# Altium schematic sheet RcMPPT-BMS-Interface.SchDoc: RcMPPT-BMS-Interface
size A4; Author: Thomas Hofmann; CompanyName: HTL St. Pölten; Organization: Altium Limited; Address1: RcMPPT; Address2: Frenchs Forest; Address3: NSW; Address4: Australia 2086; DocumentNumber: 8; Revision: 2.0; SheetNumber: 8; SheetTotal: 8
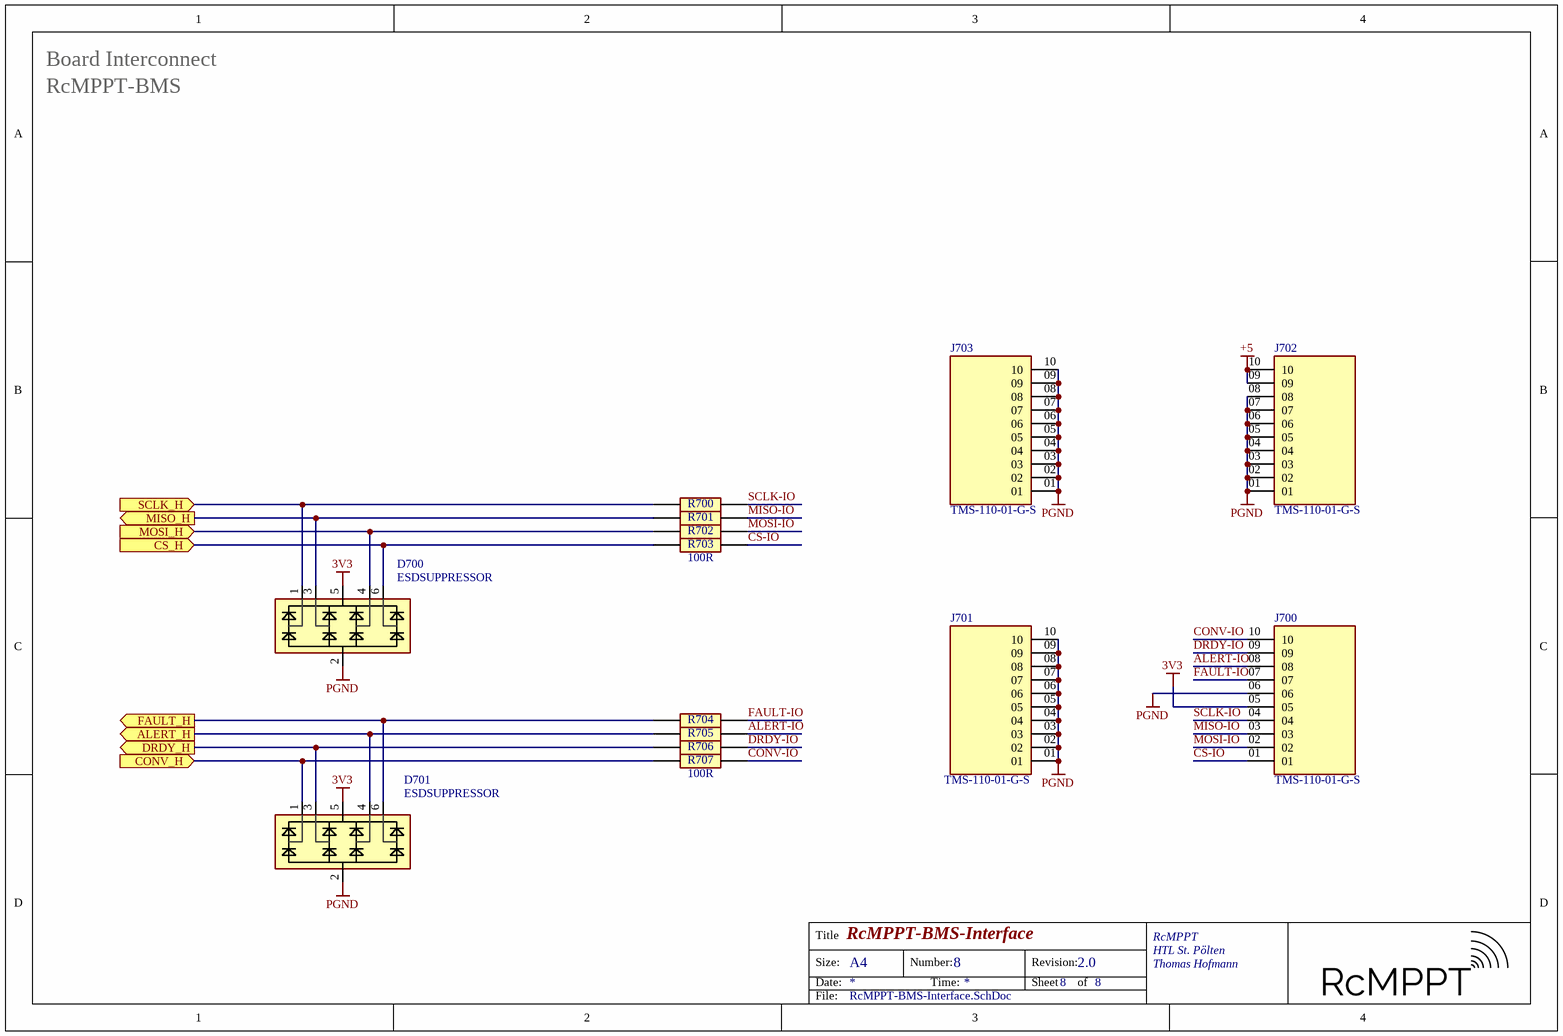
[diagram p0: RcMPPT-BMS-Interface.SchDoc]

## Parts
D700  ESDSUPPRESSOR  [SOT23-6]
D701  ESDSUPPRESSOR  [SOT23-6]
J700  TMS-110-01-G-S  [SAMTEC_TMS-110-01-G-S]
J701  TMS-110-01-G-S  [SAMTEC_TMS-110-01-G-S]
J702  TMS-110-01-G-S  [SAMTEC_TMS-110-01-G-S]
J703  TMS-110-01-G-S  [SAMTEC_TMS-110-01-G-S]
R700  100R  [RESC1005X40N]  (value not drawn)
R701  100R  [RESC1005X40N]  (value not drawn)
R702  100R  [RESC1005X40N]  (value not drawn)
R703  100R  [RESC1005X40N]
R704  100R  [RESC1005X40N]  (value not drawn)
R705  100R  [RESC1005X40N]  (value not drawn)
R706  100R  [RESC1005X40N]  (value not drawn)
R707  100R  [RESC1005X40N]

## Ports
ALERT_H (out), CONV_H (in), CS_H (in), DRDY_H (out), FAULT_H (out), MISO_H (out), MOSI_H (in), SCLK_H (in)

## Nets
3V3: D700.5(VDD) D701.5(VDD) J700.05
+5: J702.09 J702.10
PGND: D700.2(GND) D701.2(GND) J700.06 J701.01 J701.02 J701.03 J701.04 J701.05 J701.06 J701.07 J701.08 J701.09 J701.10 J702.01 J702.02 J702.03 J702.04 J702.05 J702.06 J702.07 J702.08 J703.01 J703.02 J703.03 J703.04 J703.05 J703.06 J703.07 J703.08 J703.09 J703.10
ALERT-IO: J700.08 R705.2
ALERT_H: D701.4(CH3) R705.1 ; port ALERT_H
CONV-IO: J700.10 R707.2
CONV_H: D701.1(CH1) R707.1 ; port CONV_H
CS-IO: J700.01 R703.2
CS_H: D700.6(CH4) R703.1 ; port CS_H
DRDY-IO: J700.09 R706.2
DRDY_H: D701.3(CH2) R706.1 ; port DRDY_H
FAULT-IO: J700.07 R704.2
FAULT_H: D701.6(CH4) R704.1 ; port FAULT_H
MISO-IO: J700.03 R701.2
MISO_H: D700.3(CH2) R701.1 ; port MISO_H
MOSI-IO: J700.02 R702.2
MOSI_H: D700.4(CH3) R702.1 ; port MOSI_H
SCLK-IO: J700.04 R700.2
SCLK_H: D700.1(CH1) R700.1 ; port SCLK_H

## Notes on the sheet
- Board Interconnect
- RcMPPT-BMS
- Title
- Size:
- Date:
- A4
- Number:
- Time:
- Revision:
- Sheet
- of
- RcMPPT
- File:

## Library data of the parts
D700 D701 = ESDSUPPRESSOR: TVS Diode Array; Height: 0.6mm
J700-J703 = TMS-110-01-G-S: MF: {'manufacturer': u'Samtec'}; Package: None; Availability: Unavailable; Value: *; MP: TMS-110-01-G-S; Price: None
R700-R707 = R0402: Resistor; Height: 0.4mm